# Altium project TP_FINAL.PrjPcb
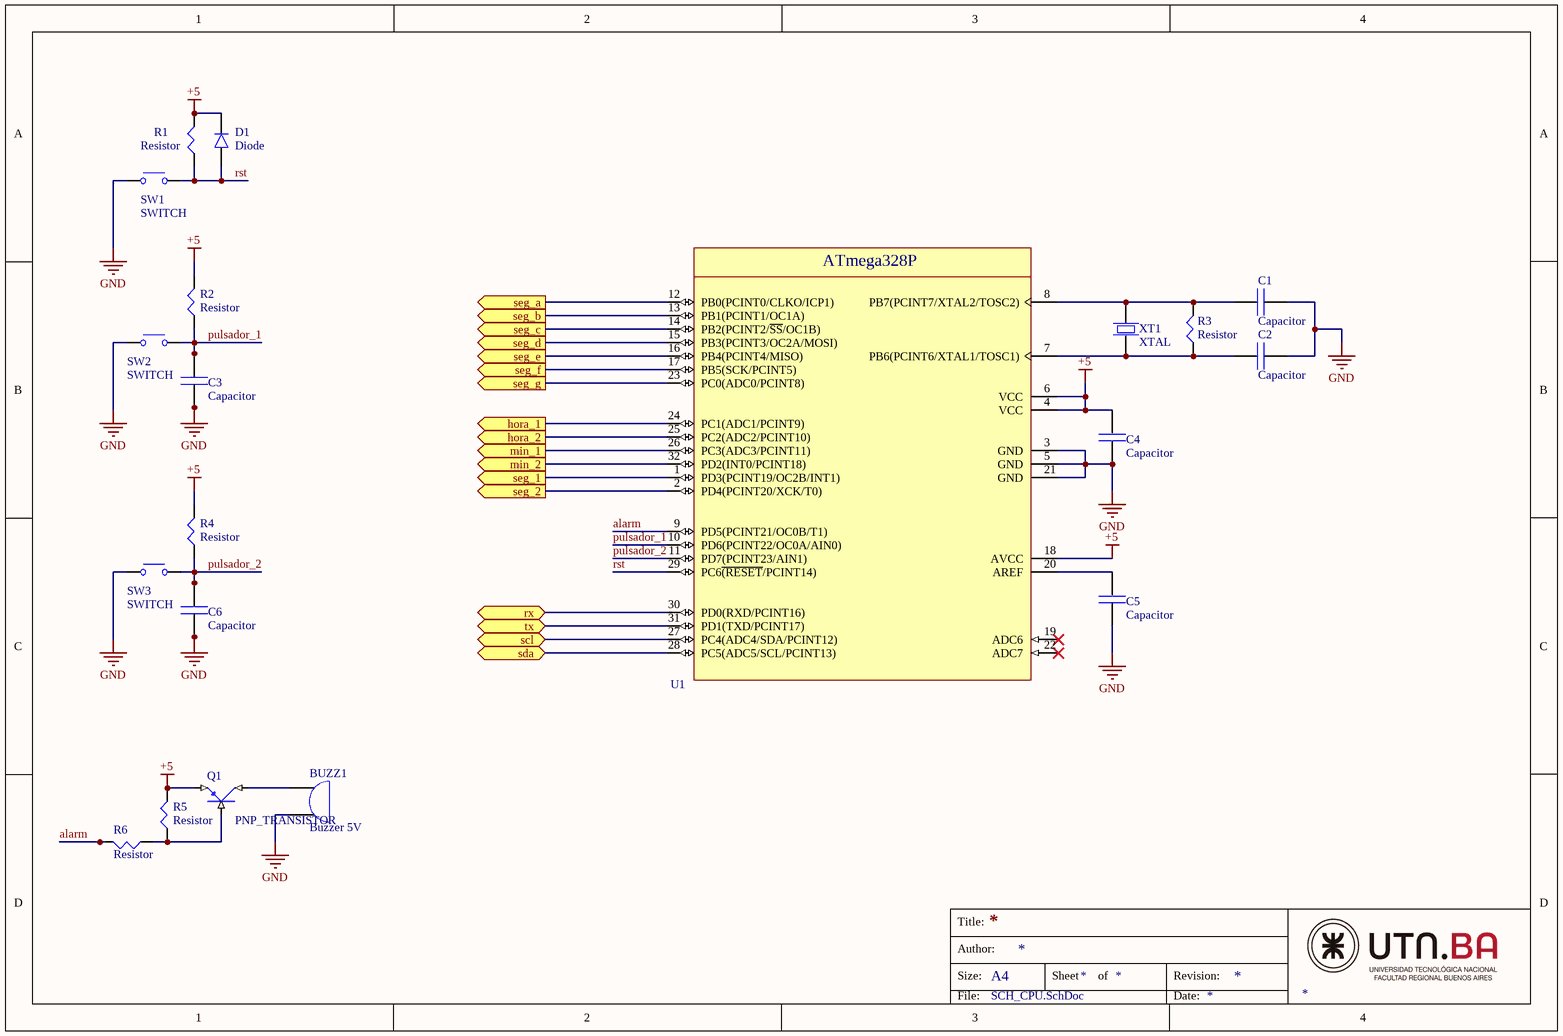
[diagram p0: SCH_CPU.SchDoc]
5 sheets, 144 parts. Net scope: flat (ports and power ports of the same name join across sheets).
Sheets:
  SCH_CPU.SchDoc
  SCH_RTC.SchDoc
  SCH_TOP.SchDoc
  SCH_POTENCIA.SchDoc
  SCH_SEGEMENTOS.SchDoc

## Sheet SCH_CPU.SchDoc
size A4

### Parts
BUZZ1  Buzzer 5V
C1  Capacitor
C2  Capacitor
C3  Capacitor
C4  Capacitor
C5  Capacitor
C6  Capacitor
D1  Diode
Q1  PNP_TRANSISTOR
R1  Resistor
R2  Resistor
R3  Resistor
R4  Resistor
R5  Resistor
R6  Resistor
SW1  SWITCH
SW2  SWITCH
SW3  SWITCH
U1  ATmega328P  (value not drawn)
XT1  XTAL

### Ports
hora_1 (out), hora_2 (out), min_1 (out), min_2 (out), rx (bidir), scl (bidir), sda (bidir), seg_1 (out), seg_2 (out), seg_a (out), seg_b (out), seg_c (out), seg_d (out), seg_e (out), seg_f (out), seg_g (out), tx (bidir)

### Nets
+5: C4.39 D1.35 Q1.3(E) R1.48 R2.48 R4.48 R5.48 U1.4(VCC) U1.6(VCC) U1.18(AVCC)
GND: BUZZ1.27 C1.38 C2.38 C3.38 C4.38 C5.38 C6.38 SW1.7 SW2.7 SW3.7 U1.3(GND) U1.5(GND) U1.21(GND)
alarm: R6.48 U1.9(PD5(PCINT21/OC0B/T1))
pulsador_1: C3.39 R2.47 SW2.6 U1.10(PD6(PCINT22/OC0A/AIN0))
pulsador_2: C6.39 R4.47 SW3.6 U1.11(PD7(PCINT23/AIN1))
rst: D1.34 R1.47 SW1.6 U1.29(PC6~{(RESET}/PCINT14))
NetBUZZ1_26: BUZZ1.26 Q1.2(C)
NetC1_39: C1.39 R3.48 U1.8(PB7(PCINT7/XTAL2/TOSC2)) XT1.4
NetC2_39: C2.39 R3.47 U1.7(PB6(PCINT6/XTAL1/TOSC1)) XT1.5
NetC5_39: C5.39 U1.20(AREF)
NetQ1_1: Q1.1(B) R5.47 R6.47
NetU1_1: U1.1(PD3(PCINT19/OC2B/INT1)) ; port seg_1
NetU1_2: U1.2(PD4(PCINT20/XCK/T0)) ; port seg_2
NetU1_12: U1.12(PB0(PCINT0/CLKO/ICP1)) ; port seg_a
NetU1_13: U1.13(PB1(PCINT1/OC1A)) ; port seg_b
NetU1_14: U1.14(PB2(PCINT2/~{SS}/OC1B)) ; port seg_c
NetU1_15: U1.15(PB3(PCINT3/OC2A/MOSI)) ; port seg_d
NetU1_16: U1.16(PB4(PCINT4/MISO)) ; port seg_e
NetU1_17: U1.17(PB5(SCK/PCINT5)) ; port seg_f
NetU1_23: U1.23(PC0(ADC0/PCINT8)) ; port seg_g
NetU1_24: U1.24(PC1(ADC1/PCINT9)) ; port hora_1
NetU1_25: U1.25(PC2(ADC2/PCINT10)) ; port hora_2
NetU1_26: U1.26(PC3(ADC3/PCINT11)) ; port min_1
NetU1_27: U1.27(PC4(ADC4/SDA/PCINT12)) ; port scl
NetU1_28: U1.28(PC5(ADC5/SCL/PCINT13)) ; port sda
NetU1_30: U1.30(PD0(RXD/PCINT16)) ; port rx
NetU1_31: U1.31(PD1(TXD/PCINT17)) ; port tx
NetU1_32: U1.32(PD2(INT0/PCINT18)) ; port min_2

Not connected (* = marked no-connect by the designer): U1 19(ADC6)* 22(ADC7)*

### Notes on the sheet
- Title:
- Size:
- Author:
- A4
- Sheet
- of
- Revision:
- File:
- Date:

### Library data of the parts
BUZZ1 = Buzzer
C1-C6 = Capacitor: 100nF x 50v
D1 = Diode: Signal Diode
SW1-SW3 = SWITCH: NO Switch
U1 = ATmega328P: Microcontroller
XT1 = XTAL: crystal piezoelectric

## Sheet SCH_RTC.SchDoc
size A4
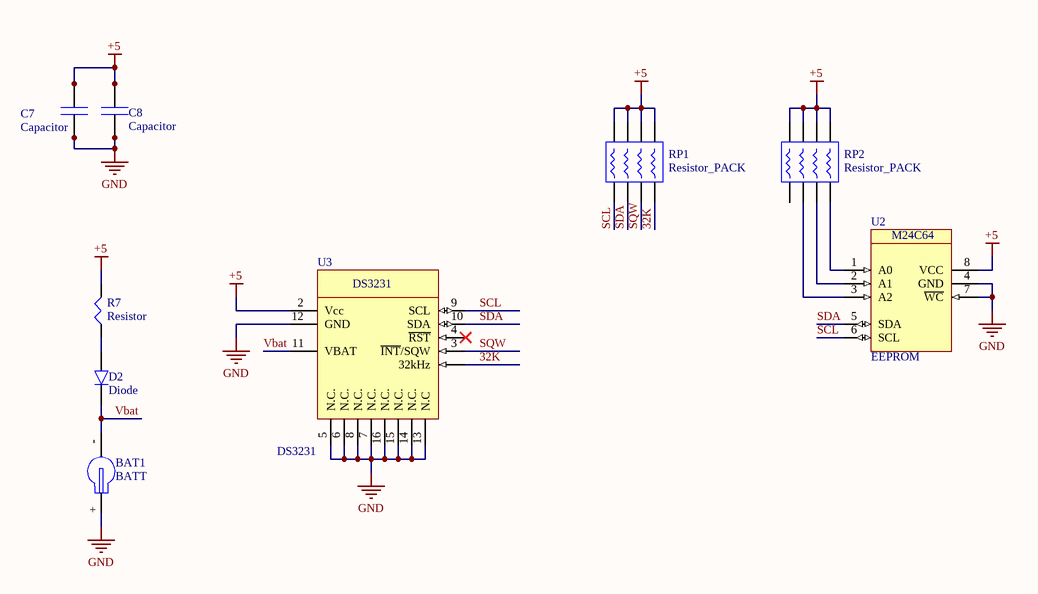
[diagram p1: SCH_RTC.SchDoc]

### Parts
BAT1  BATT
C7  Capacitor
C8  Capacitor
D2  Diode
R7  Resistor
RP1  Resistor_PACK
RP2  Resistor_PACK
U2  EEPROM
U3  DS3231

### Nets
+5: C7.39 C8.39 R7.48 RP1.1 RP1.3 RP1.5 RP1.7 RP2.1 RP2.3 RP2.5 RP2.7 U2.8(VCC) U3.2(Vcc)
GND: BAT1.+ C7.38 C8.38 U2.4(GND) U2.7(~{WC}) U3.5(N.C.) U3.6(N.C.) U3.7(N.C.) U3.8(N.C.) U3.12(GND) U3.13(N.C) U3.14(N.C.) U3.15(N.C.) U3.16(N.C.)
32K: RP1.8 U3.1(32kHz)
SCL: RP1.2 U2.6(SCL) U3.9(SCL)
SDA: RP1.4 U2.5(SDA) U3.10(SDA)
SQW: RP1.6 U3.3(~{INT}/SQW)
Vbat: BAT1.- D2.35 U3.11(VBAT)
NetD2_34: D2.34 R7.47
NetRP2_4: RP2.4 U2.3(A2)
NetRP2_6: RP2.6 U2.2(A1)
NetRP2_8: RP2.8 U2.1(A0)

Not connected (* = marked no-connect by the designer): RP2 2; U3 4(~{RST})*

### Notes on the sheet
- Title:
- Size:
- Author:
- A4
- Sheet
- of
- Revision:
- File:
- Date:
- (in symbol EEPROM) M24C64

### Library data of the parts
BAT1 = BATT: Porta Pila CR2032
C7 C8 = Capacitor: 100nF x 50v
D2 = Diode: Signal Diode
U3 = DS3231: Real Time Clock

## Sheet SCH_TOP.SchDoc
size A4
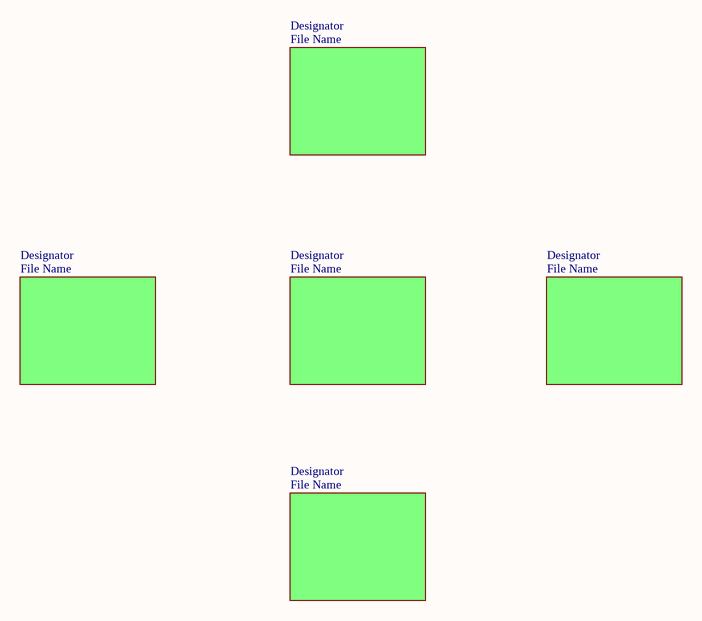
[diagram p2: SCH_TOP.SchDoc]

### Sub-sheets
Designator = File Name (file not in this document): no entries
Designator = File Name (file not in this document): no entries
Designator = File Name (file not in this document): no entries
Designator = File Name (file not in this document): no entries
Designator = File Name (file not in this document): no entries

## Sheet SCH_POTENCIA.SchDoc
size A4
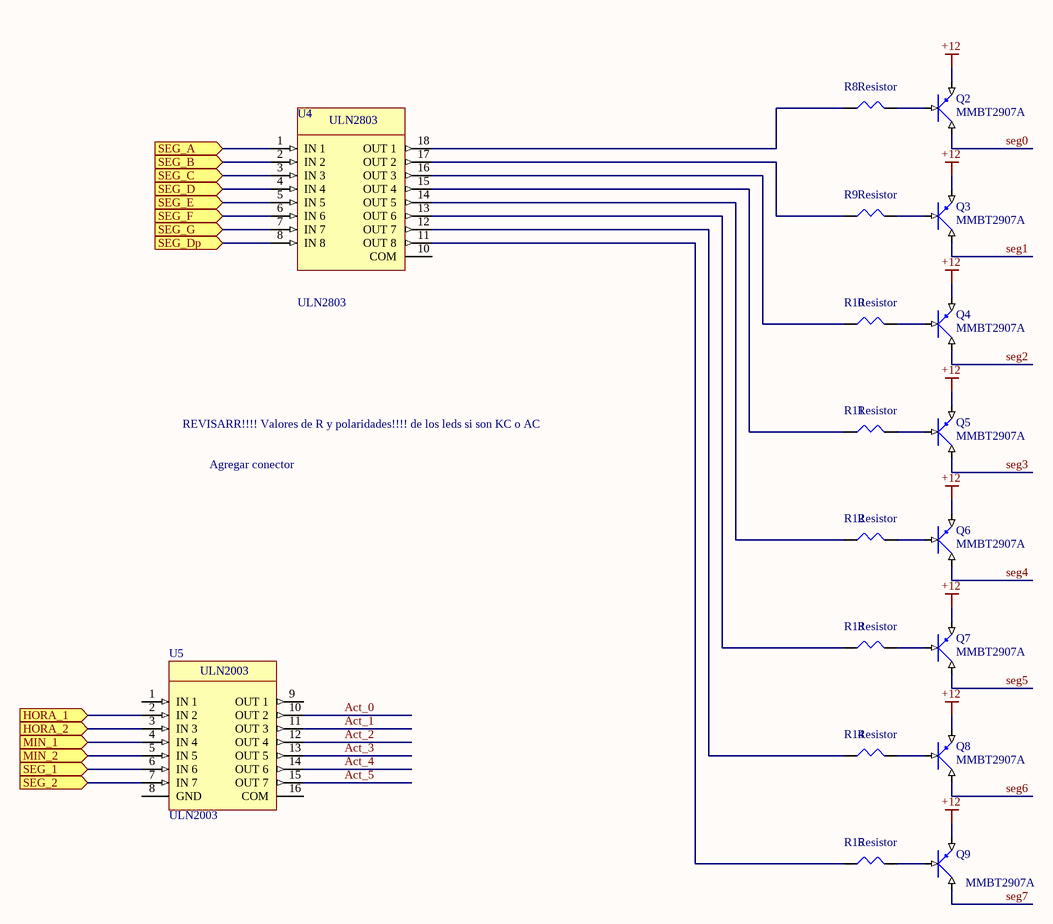
[diagram p3: SCH_POTENCIA.SchDoc]

### Parts
Q2  MMBT2907A
Q3  MMBT2907A
Q4  MMBT2907A
Q5  MMBT2907A
Q6  MMBT2907A
Q7  MMBT2907A
Q8  MMBT2907A
Q9  MMBT2907A
R8  Resistor
R9  Resistor
R10  Resistor
R11  Resistor
R12  Resistor
R13  Resistor
R14  Resistor
R15  Resistor
U4  ULN2803
U5  ULN2003

### Ports
HORA_1 (in), HORA_2 (in), MIN_1 (in), MIN_2 (in), SEG_1 (in), SEG_2 (in), SEG_A (in), SEG_B (in), SEG_C (in), SEG_D (in), SEG_Dp (in), SEG_E (in), SEG_F (in), SEG_G (in)

### Nets
+12: Q2.3(E) Q3.3(E) Q4.3(E) Q5.3(E) Q6.3(E) Q7.3(E) Q8.3(E) Q9.3(E)
Act_0: U5.10(OUT_2)
Act_1: U5.11(OUT_3)
Act_2: U5.12(OUT_4)
Act_3: U5.13(OUT_5)
Act_4: U5.14(OUT_6)
Act_5: U5.15(OUT_7)
seg0: Q2.2(C)
seg1: Q3.2(C)
seg2: Q4.2(C)
seg3: Q5.2(C)
seg4: Q6.2(C)
seg5: Q7.2(C)
seg6: Q8.2(C)
seg7: Q9.2(C)
NetQ2_1: Q2.1(B) R8.48
NetQ3_1: Q3.1(B) R9.48
NetQ4_1: Q4.1(B) R10.48
NetQ5_1: Q5.1(B) R11.48
NetQ6_1: Q6.1(B) R12.48
NetQ7_1: Q7.1(B) R13.48
NetQ8_1: Q8.1(B) R14.48
NetQ9_1: Q9.1(B) R15.48
NetR8_47: R8.47 U4.18(OUT_1)
NetR9_47: R9.47 U4.17(OUT_2)
NetR10_47: R10.47 U4.16(OUT_3)
NetR11_47: R11.47 U4.15(OUT_4)
NetR12_47: R12.47 U4.14(OUT_5)
NetR13_47: R13.47 U4.13(OUT_6)
NetR14_47: R14.47 U4.12(OUT_7)
NetR15_47: R15.47 U4.11(OUT_8)
NetU1_1: U5.6(IN_6) ; port SEG_1
NetU1_2: U5.7(IN_7) ; port SEG_2
NetU1_12: U4.1(IN_1) ; port SEG_A
NetU1_13: U4.2(IN_2) ; port SEG_B
NetU1_14: U4.3(IN_3) ; port SEG_C
NetU1_15: U4.4(IN_4) ; port SEG_D
NetU1_16: U4.5(IN_5) ; port SEG_E
NetU1_17: U4.6(IN_6) ; port SEG_F
NetU1_23: U4.7(IN_7) ; port SEG_G
NetU1_24: U5.2(IN_2) ; port HORA_1
NetU1_25: U5.3(IN_3) ; port HORA_2
NetU1_26: U5.4(IN_4) ; port MIN_1
NetU1_32: U5.5(IN_5) ; port MIN_2
NetU4_8: U4.8(IN_8) ; port SEG_Dp

Not connected (* = marked no-connect by the designer): U4 10(COM); U5 1(IN_1) 8(GND) 9(OUT_1) 16(COM)

### Notes on the sheet
- REVISARR!!!! Valores de R y polaridades!!!! de los leds si son KC o AC
- Agregar conector
- Title:
- Size:
- Author:
- A4
- Sheet
- of
- Revision:
- File:
- Date:

### Library data of the parts
Q2-Q9 = PNP_TRANSISTOR: Número de pieza de Digi-Key MMBT2907A-FDICT-ND

## Sheet SCH_SEGEMENTOS.SchDoc
size A4
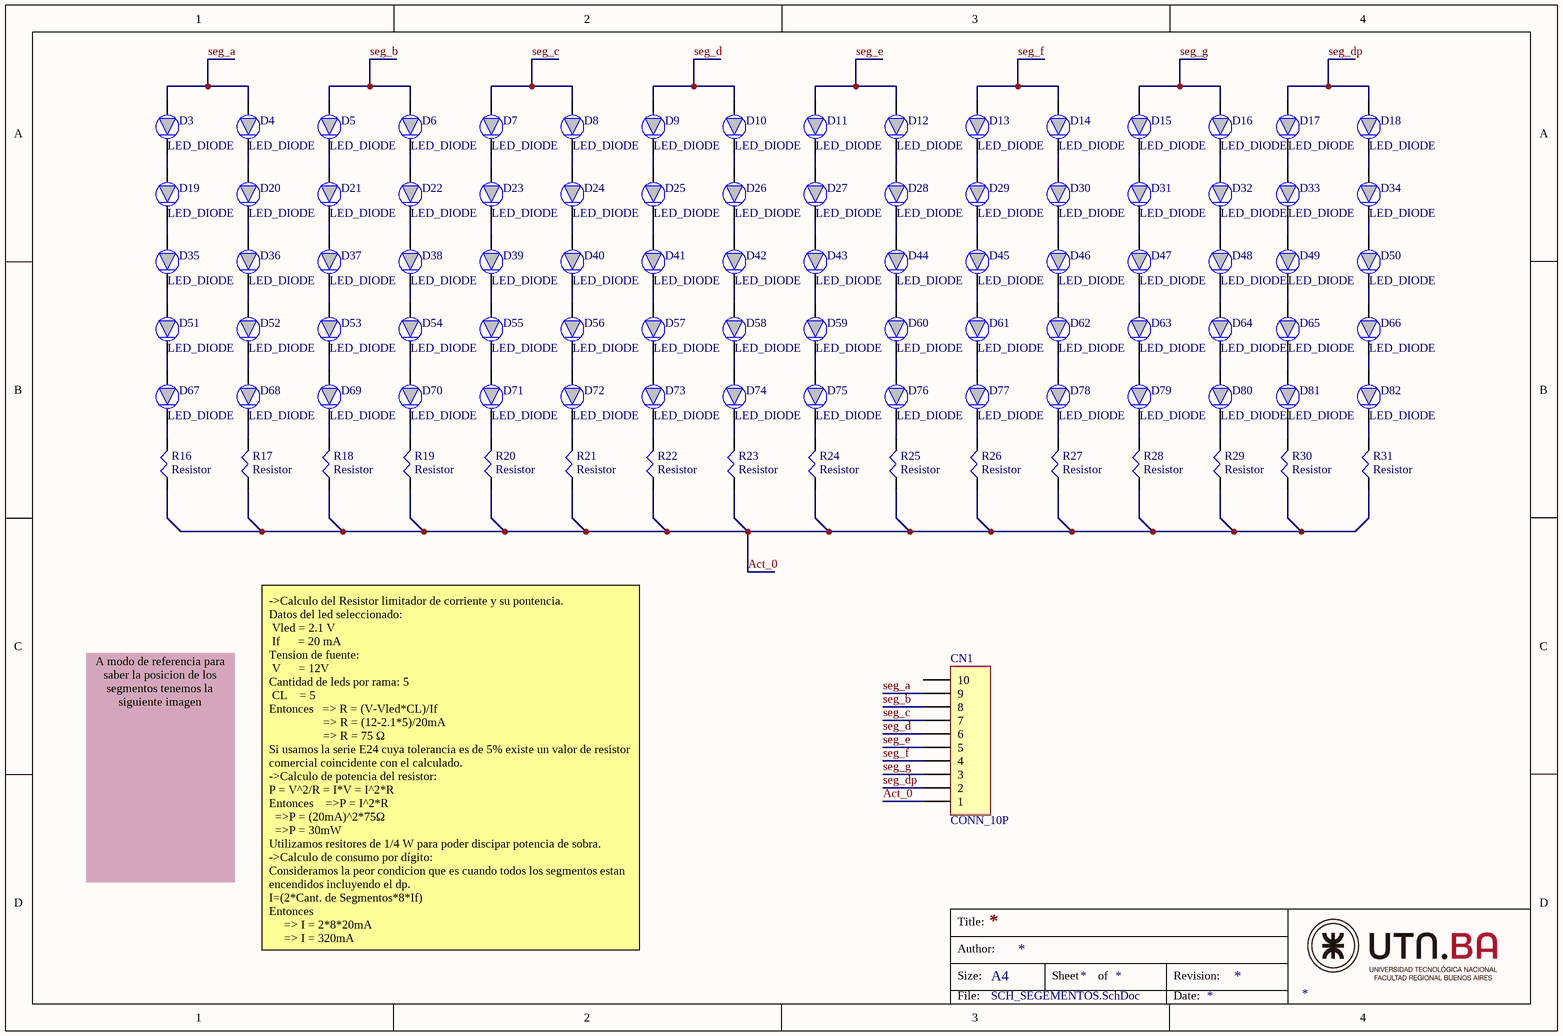
[diagram p4: SCH_SEGEMENTOS.SchDoc]

### Parts
CN1  CONN_10P
D3  LED_DIODE
D4  LED_DIODE
D5  LED_DIODE
D6  LED_DIODE
D7  LED_DIODE
D8  LED_DIODE
D9  LED_DIODE
D10  LED_DIODE
D11  LED_DIODE
D12  LED_DIODE
D13  LED_DIODE
D14  LED_DIODE
D15  LED_DIODE
D16  LED_DIODE
D17  LED_DIODE
D18  LED_DIODE
D19  LED_DIODE
D20  LED_DIODE
D21  LED_DIODE
D22  LED_DIODE
D23  LED_DIODE
D24  LED_DIODE
D25  LED_DIODE
D26  LED_DIODE
D27  LED_DIODE
D28  LED_DIODE
D29  LED_DIODE
D30  LED_DIODE
D31  LED_DIODE
D32  LED_DIODE
D33  LED_DIODE
D34  LED_DIODE
D35  LED_DIODE
D36  LED_DIODE
D37  LED_DIODE
D38  LED_DIODE
D39  LED_DIODE
D40  LED_DIODE
D41  LED_DIODE
D42  LED_DIODE
D43  LED_DIODE
D44  LED_DIODE
D45  LED_DIODE
D46  LED_DIODE
D47  LED_DIODE
D48  LED_DIODE
D49  LED_DIODE
D50  LED_DIODE
D51  LED_DIODE
D52  LED_DIODE
D53  LED_DIODE
D54  LED_DIODE
D55  LED_DIODE
D56  LED_DIODE
D57  LED_DIODE
D58  LED_DIODE
D59  LED_DIODE
D60  LED_DIODE
D61  LED_DIODE
D62  LED_DIODE
D63  LED_DIODE
D64  LED_DIODE
D65  LED_DIODE
D66  LED_DIODE
D67  LED_DIODE
D68  LED_DIODE
D69  LED_DIODE
D70  LED_DIODE
D71  LED_DIODE
D72  LED_DIODE
D73  LED_DIODE
D74  LED_DIODE
D75  LED_DIODE
D76  LED_DIODE
D77  LED_DIODE
D78  LED_DIODE
D79  LED_DIODE
D80  LED_DIODE
D81  LED_DIODE
D82  LED_DIODE
R16  Resistor
R17  Resistor
R18  Resistor
R19  Resistor
R20  Resistor
R21  Resistor
R22  Resistor
R23  Resistor
R24  Resistor
R25  Resistor
R26  Resistor
R27  Resistor
R28  Resistor
R29  Resistor
R30  Resistor
R31  Resistor

### Nets
Act_0: CN1.1 R16.47 R17.47 R18.47 R19.47 R20.47 R21.47 R22.47 R23.47 R24.47 R25.47 R26.47 R27.47 R28.47 R29.47 R30.47 R31.47
seg_a: CN1.9 D3.12 D4.12
seg_b: CN1.8 D5.12 D6.12
seg_c: CN1.7 D7.12 D8.12
seg_d: CN1.6 D9.12 D10.12
seg_dp: CN1.2 D17.12 D18.12
seg_e: CN1.5 D11.12 D12.12
seg_f: CN1.4 D13.12 D14.12
seg_g: CN1.3 D15.12 D16.12
NetD3_11: D3.11 D19.12
NetD4_11: D4.11 D20.12
NetD5_11: D5.11 D21.12
NetD6_11: D6.11 D22.12
NetD7_11: D7.11 D23.12
NetD8_11: D8.11 D24.12
NetD9_11: D9.11 D25.12
NetD10_11: D10.11 D26.12
NetD11_11: D11.11 D27.12
NetD12_11: D12.11 D28.12
NetD13_11: D13.11 D29.12
NetD14_11: D14.11 D30.12
NetD15_11: D15.11 D31.12
NetD16_11: D16.11 D32.12
NetD17_11: D17.11 D33.12
NetD18_11: D18.11 D34.12
NetD19_11: D19.11 D35.12
NetD20_11: D20.11 D36.12
NetD21_11: D21.11 D37.12
NetD22_11: D22.11 D38.12
NetD23_11: D23.11 D39.12
NetD24_11: D24.11 D40.12
NetD25_11: D25.11 D41.12
NetD26_11: D26.11 D42.12
NetD27_11: D27.11 D43.12
NetD28_11: D28.11 D44.12
NetD29_11: D29.11 D45.12
NetD30_11: D30.11 D46.12
NetD31_11: D31.11 D47.12
NetD32_11: D32.11 D48.12
NetD33_11: D33.11 D49.12
NetD34_11: D34.11 D50.12
NetD35_11: D35.11 D51.12
NetD36_11: D36.11 D52.12
NetD37_11: D37.11 D53.12
NetD38_11: D38.11 D54.12
NetD39_11: D39.11 D55.12
NetD40_11: D40.11 D56.12
NetD41_11: D41.11 D57.12
NetD42_11: D42.11 D58.12
NetD43_11: D43.11 D59.12
NetD44_11: D44.11 D60.12
NetD45_11: D45.11 D61.12
NetD46_11: D46.11 D62.12
NetD47_11: D47.11 D63.12
NetD48_11: D48.11 D64.12
NetD49_11: D49.11 D65.12
NetD50_11: D50.11 D66.12
NetD51_11: D51.11 D67.12
NetD52_11: D52.11 D68.12
NetD53_11: D53.11 D69.12
NetD54_11: D54.11 D70.12
NetD55_11: D55.11 D71.12
NetD56_11: D56.11 D72.12
NetD57_11: D57.11 D73.12
NetD58_11: D58.11 D74.12
NetD59_11: D59.11 D75.12
NetD60_11: D60.11 D76.12
NetD61_11: D61.11 D77.12
NetD62_11: D62.11 D78.12
NetD63_11: D63.11 D79.12
NetD64_11: D64.11 D80.12
NetD65_11: D65.11 D81.12
NetD66_11: D66.11 D82.12
NetD67_11: D67.11 R16.48
NetD68_11: D68.11 R17.48
NetD69_11: D69.11 R18.48
NetD70_11: D70.11 R19.48
NetD71_11: D71.11 R20.48
NetD72_11: D72.11 R21.48
NetD73_11: D73.11 R22.48
NetD74_11: D74.11 R23.48
NetD75_11: D75.11 R24.48
NetD76_11: D76.11 R25.48
NetD77_11: D77.11 R26.48
NetD78_11: D78.11 R27.48
NetD79_11: D79.11 R28.48
NetD80_11: D80.11 R29.48
NetD81_11: D81.11 R30.48
NetD82_11: D82.11 R31.48

Not connected (* = marked no-connect by the designer): CN1 10

### Notes on the sheet
- A modo de referencia para saber la posicion de los segmentos tenemos la siguiente imagen
- ->Calculo del Resistor limitador de corriente y su pontencia.
  Datos del led seleccionado:
  Vled = 2.1 V
  If      = 20 mA
  Tension de fuente:
  V      = 12V
  Cantidad de leds por rama: 5
  CL    = 5
  Entonces   => R = (V-Vled*CL)/If
  => R = (12-2.1*5)/20mA
  => R = 75 Ω
  Si usamos la serie E24 cuya tolerancia es de 5% existe un valor de resistor comercial coincidente con el calculado.
  ->Calculo de potencia del resistor:
  P = V^2/R = I*V = I^2*R
  Entonces    =>P = I^2*R
  =>P = (20mA)^2*75Ω
  =>P = 30mW
  Utilizamos resitores de 1/4 W para poder discipar potencia de sobra.
  ->Calculo de consumo por dígito:
  Consideramos la peor condicion que es cuando todos los segmentos estan encendidos incluyendo el dp.
  I=(2*Cant. de Segmentos*8*If)
  Entonces
  => I = 2*8*20mA
  => I = 320mA
- Title:
- Size:
- Author:
- A4
- Sheet
- of
- Revision:
- File:
- Date:

### Library data of the parts
CN1 = CONN_10P: Connector Generic 10 Vias
D3-D82 = LED_DIODE: LED rojo 0805

## Nets that join several sheets
+5: SCH_CPU (10 pins), SCH_RTC (13 pins)
GND: SCH_CPU (13 pins), SCH_RTC (14 pins)
NetU1_1: SCH_CPU (U1.1), SCH_POTENCIA (U5.6)
NetU1_2: SCH_CPU (U1.2), SCH_POTENCIA (U5.7)
NetU1_12: SCH_CPU (U1.12), SCH_POTENCIA (U4.1)
NetU1_13: SCH_CPU (U1.13), SCH_POTENCIA (U4.2)
NetU1_14: SCH_CPU (U1.14), SCH_POTENCIA (U4.3)
NetU1_15: SCH_CPU (U1.15), SCH_POTENCIA (U4.4)
NetU1_16: SCH_CPU (U1.16), SCH_POTENCIA (U4.5)
NetU1_17: SCH_CPU (U1.17), SCH_POTENCIA (U4.6)
NetU1_23: SCH_CPU (U1.23), SCH_POTENCIA (U4.7)
NetU1_24: SCH_CPU (U1.24), SCH_POTENCIA (U5.2)
NetU1_25: SCH_CPU (U1.25), SCH_POTENCIA (U5.3)
NetU1_26: SCH_CPU (U1.26), SCH_POTENCIA (U5.4)
NetU1_32: SCH_CPU (U1.32), SCH_POTENCIA (U5.5)